# Altium schematic sheet [03] GSM_GPRS_GPS.SchDoc
size A4
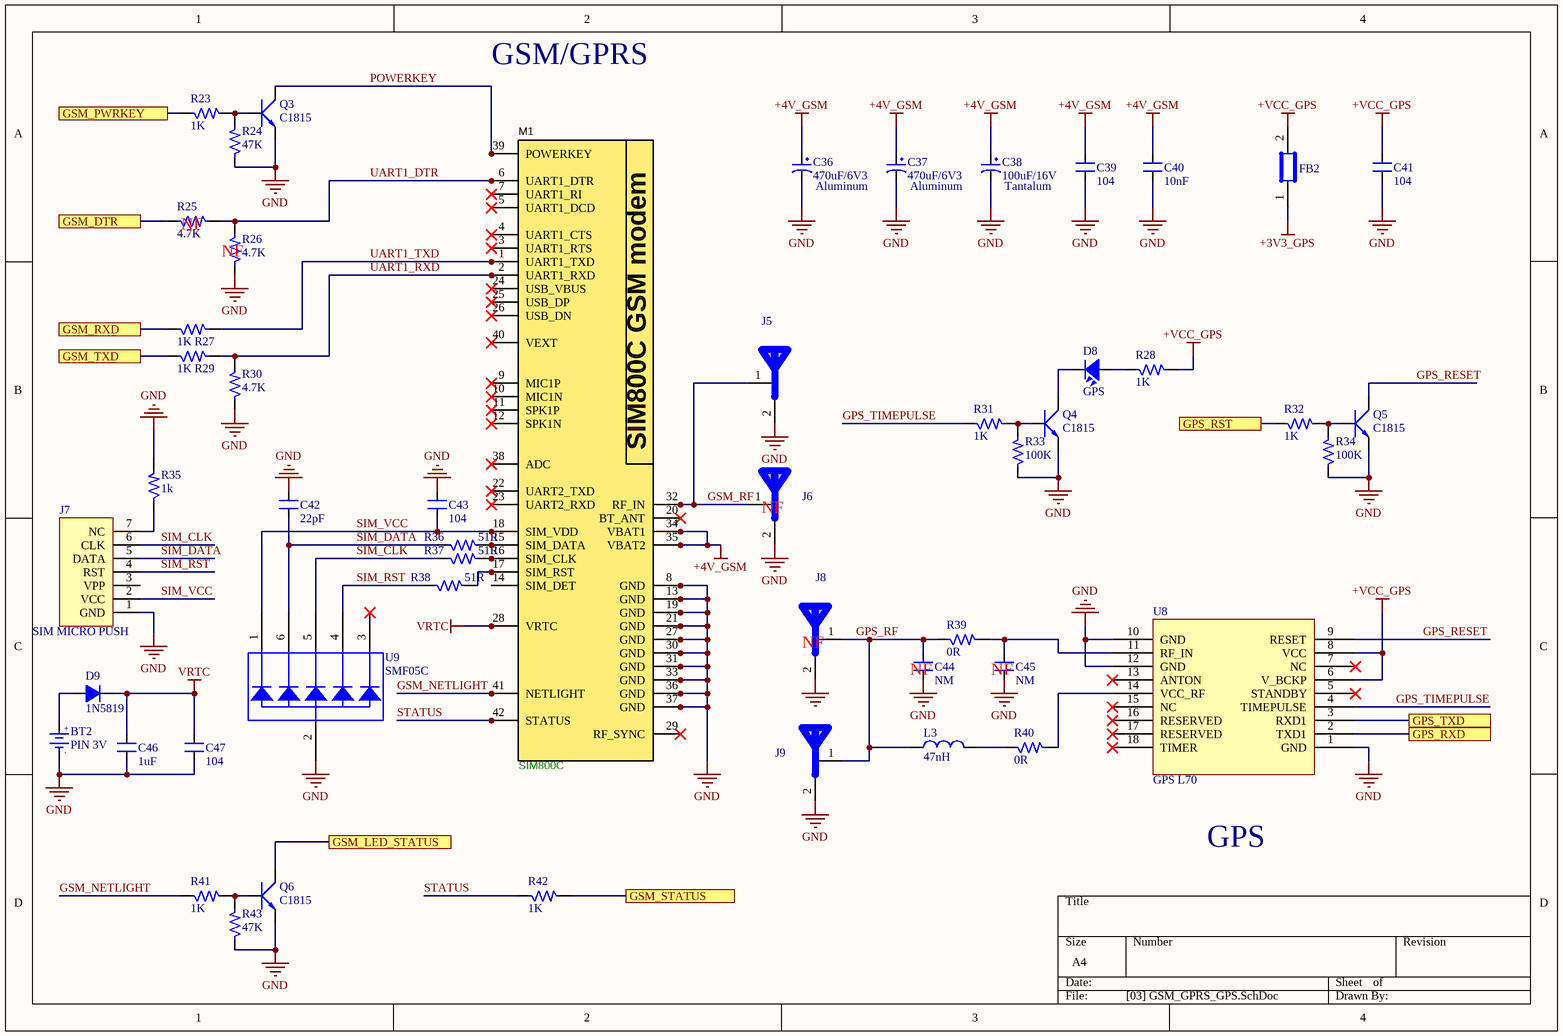
[diagram p0: [03] GSM_GPRS_GPS.SchDoc]

## Parts
BT2  PIN 3V  [CR1220 SMD]
C36  470uF/6V3  [C_Alu_6.3x7.7]
C37  470uF/6V3  [C_Alu_6.3x7.7]
C38  100uF/16V  [C_7343_40]
C39  104  [CAP_0805]
C40  10nF  [CAP_0805]
C41  104  [CAP_0805]
C42  22pF  [C0603 SMT]
C43  104  [C0603 SMT]
C44  NM  [C0603 SMT]
C45  NM  [C0603 SMT]
C46  1uF  [C0603 SMT]
C47  104  [C0603 SMT]
D8  GPS  [LED-0805-Red]
D9  1N5819  [SOD123]
FB2  BLM21PG600SN1D  [R0805]  (value not drawn)
J5  GPS_ANTENNA  [Antenna-MCX5.08-H5]  (value not drawn)
J6  GSM  [Antenna-IPEX]  (value not drawn)
J7  SIM MICRO PUSH  [MICRO_SIM_HOLDER]
J8  GPS  [Antenna-IPEX]  (value not drawn)
J9  GPS_ANTENNA  [Antenna-MCX5.08-H5]  (value not drawn)
L3  47nH  [C0805]
M1  SIM800C  [SIM800C]
Q3  C1815  [SOT23B]
Q4  C1815  [SOT23B]
Q5  C1815  [SOT23B]
Q6  C1815  [SOT23B]
R23  1K  [R0603 -SMT]
R24  47K  [R0603 -SMT]
R25  4.7K  [R0603 -SMT]
R26  4.7K  [R0603 -SMT]
R27  1K  [R0603 -SMT]
R28  1K  [RES-SMD-0805]
R29  1K  [R0603 -SMT]
R30  4.7K  [R0603 -SMT]
R31  1K  [RES-SMD-0805]
R32  1K  [RES-SMD-0805]
R33  100K  [RES-SMD-0805]
R34  100K  [RES-SMD-0805]
R35  1k  [RES-SMD-0805]
R36  51R  [R0603 -SMT]
R37  51R  [R0603 -SMT]
R38  51R  [R0603 -SMT]
R39  0R  [R0603 -SMT]
R40  0R  [R0603 -SMT]
R41  1K  [R0603 -SMT]
R42  1K  [R0603 -SMT]
R43  47K  [R0603 -SMT]
U8  GPS L70  [GPS L70]
U9  SMF05C  [SOT_363_6]

## Ports
GPS_RST, GPS_RXD, GPS_TXD, GSM_DTR, GSM_LED_STATUS, GSM_PWRKEY, GSM_RXD, GSM_STATUS, GSM_TXD

## Nets
+3V3_GPS: FB2.1
+4V_GSM: C36.1 C37.1 C38.1 C39.1 C40.1 M1.34(VBAT1) M1.35(VBAT2)
+VCC_GPS: C41.2 FB2.2 R28.2 U8.6(V_BCKP) U8.8(VCC)
GND: BT2.2(GND) C36.2 C37.2 C38.2 C39.2 C40.2 C41.1 C42.2 C43.2 C44.1 C45.1 C46.1 C47.1 J5.2(GND) J6.2(GND) J7.1(GND) J8.2(GND) J9.2(GND) M1.8(GND) M1.13(GND) M1.19(GND) M1.21(GND) M1.27(GND) M1.30(GND) M1.31(GND) M1.33(GND) M1.36(GND) M1.37(GND) Q3.1(E) Q4.1(E) Q5.1(E) Q6.1(E) R24.1 R26.1 R30.1 R33.1 R34.1 R35.2 R43.1 U8.1(GND) U8.10(GND) U8.12(GND) U9.2(A)
VRTC: C46.2 C47.2 D9.2(K) M1.28(VRTC)
GPS_RESET: Q5.2(C) U8.9(RESET)
GPS_RF: C44.2 J8.1(GND) J9.1(GND) L3.1 R39.1
GPS_RST: R32.1 ; port GPS_RST
GPS_RXD: U8.2(TXD1) ; port GPS_RXD
GPS_TIMEPULSE: R31.1 U8.4(TIMEPULSE)
GPS_TXD: U8.3(RXD1) ; port GPS_TXD
GSM_DTR: R25.1 ; port GSM_DTR
GSM_LED_STATUS: Q6.2(C) ; port GSM_LED_STATUS
GSM_NETLIGHT: M1.41(NETLIGHT) R41.1
GSM_PWRKEY: R23.1 ; port GSM_PWRKEY
GSM_RF: J5.1(GND) J6.1(GND) M1.32(RF_IN)
GSM_RXD: R27.1 ; port GSM_RXD
GSM_STATUS: R42.2 ; port GSM_STATUS
GSM_TXD: R29.1 ; port GSM_TXD
POWERKEY: M1.39(POWERKEY) Q3.2(C)
SIM_CLK: J7.6(CLK) R37.1 U9.5(K4)
SIM_DATA: C42.1 J7.5(DATA) R36.1 U9.6(K5)
SIM_RST: J7.4(RST) R38.1 U9.4(K3)
SIM_VCC: C43.1 J7.2(VCC) M1.18(SIM_VDD) U9.1(K1)
STATUS: M1.42(STATUS) R42.1
UART1_DTR: M1.6(UART1_DTR) R25.2 R26.2
UART1_RXD: M1.2(UART1_RXD) R29.2 R30.2
UART1_TXD: M1.1(UART1_TXD) R27.2
NetBT2_1: BT2.1(+3V) D9.1(A)
NetC45_2: C45.2 R39.2 U8.11(RF_IN)
NetD8_1: D8.1 R28.1
NetD8_2: D8.2 Q4.2(C)
NetJ7_7: J7.7(NC) R35.1
NetL3_2: L3.2 R40.1
NetM1_15: M1.15(SIM_DATA) R36.2
NetM1_16: M1.16(SIM_CLK) R37.2
NetM1_17: M1.17(SIM_RST) R38.2
NetQ3_3: Q3.3(B) R23.2 R24.2
NetQ4_3: Q4.3(B) R31.2 R33.2
NetQ5_3: Q5.3(B) R32.2 R34.2
NetQ6_3: Q6.3(B) R41.2 R43.2
NetR40_2: R40.2 U8.14(VCC_RF)

Not connected (* = marked no-connect by the designer): J7 3(VPP); M1 3(UART1_RTS)* 4(UART1_CTS)* 5(UART1_DCD)* 7(UART1_RI)* 9(MIC1P)* 10(MIC1N)* 11(SPK1P)* 12(SPK1N)* 14(SIM_DET) 20(BT_ANT)* 22(UART2_TXD)* 23(UART2_RXD)* 24(USB_VBUS)* 25(USB_DP)* 26(USB_DN)* 29(RF_SYNC)* 38(ADC)* 40(VEXT)*; U8 5(STANDBY)* 7(NC)* 13(ANTON)* 15(NC)* 16(RESERVED)* 17(RESERVED)* 18(TIMER)*; U9 3(K2)*

## Notes on the sheet
- GSM/GPRS
- (near R25) NF
- (near C36) Aluminum
- (near C37) Aluminum
- (near C38) Tantalum
- (near R26) NF
- (near J6) NF
- (near J8) NF
- (near C44) NF
- (near C45) NF
- GPS
- (in symbol PIN 3V) +; -
- (in symbol SIM800C) SIM800C GSM modem

## Library data of the parts
BT2 = PIN 3V: Battery 3VDC; Value: PIN 3V
C36 C37 = C-Alu-Tantalum: Cap Aluminum; Value: 10uF/50V; Description 1: 10 => 220uF/6,3V/10V - 10uF => 100uF/16V; Description 2: 0,1uF => 33uF/50V - 10uF => 22uF/63V; Description 3: 0,47uF => 10uF/100V
C38 = C-Alu-Tantalum: Cap Tantalum 7343; Value: 10uF/50V; Description 1: 10 => 220uF/6,3V/10V - 10uF => 100uF/16V; Description 2: 0,1uF => 33uF/50V - 10uF => 22uF/63V; Description 3: 0,47uF => 10uF/100V
C39-C47 = CM: Cap SMD; Value: 103
D8 = LED: LED Single colour Green and Red; Value: LED 3 ly Single Colour
D9 = D1A: Diode 1A; Value: 1N4007
FB2 = Ferrite Bead
J5 J6 J8 J9 = ANTEN
L3 = L1: Inductor; Value: 150 mH
Q3-Q6 = C1815: NPN 600mW, ECB; Value: C1815
R23 R27-R29 R31 R32 R35 R41 R42 = RM: Resistor SMD; Value: 1K
R24-R26 R30 R33 R34 R36-R40 R43 = RM: Resistor SMD; Value: 1K
U9 = SMF05C: ESD Protection